# Altium schematic sheet BMS_BatteryStackMonitor.SchDoc
size A
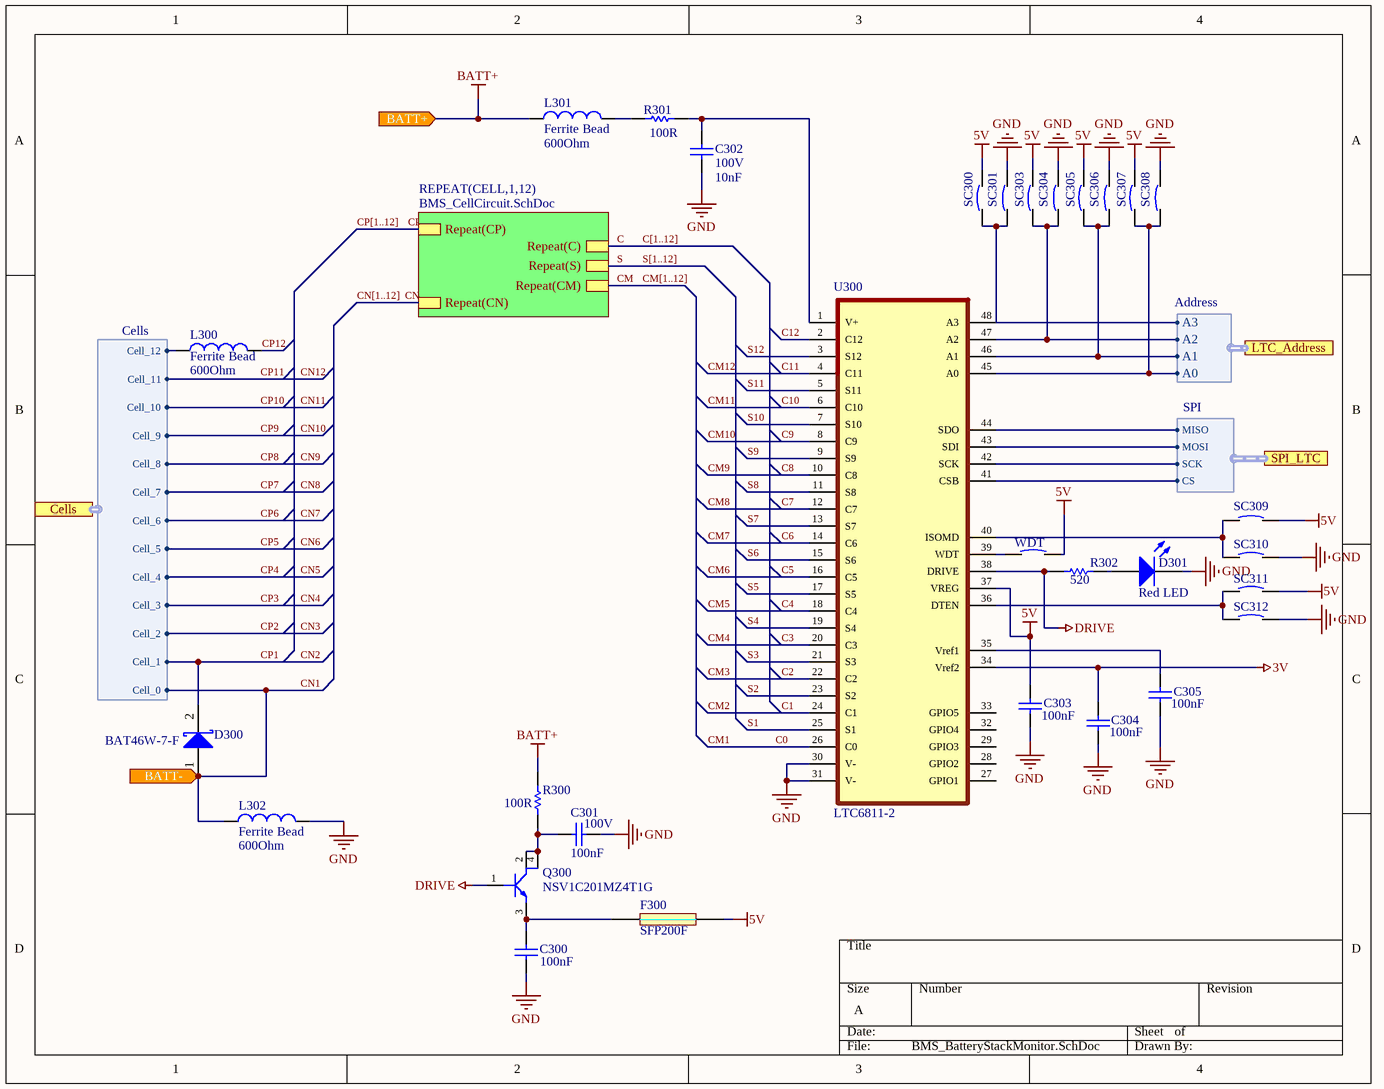
[diagram p0: BMS_BatteryStackMonitor.SchDoc]

## Parts
C300  value 100nF  [CAPC2012X14N]  (hidden comment: 100V)
C301  100V  value 100nF  [CAPC2012X14N]
C302  100V  value 10nF  [CAPC2012X14N]
C303  value 100nF  [CAPC2012X14N]  (hidden comment: 100V)
C304  value 100nF  [CAPC2012X14N]  (hidden comment: 100V)
C305  value 100nF  [CAPC2012X14N]  (hidden comment: 100V)
D300  BAT46W-7-F  [SODFL370X135-2N]
D301  Red LED  [SMD RED LED]
F300  SFP200F  [DIOC3216X12N]
L300  Ferrite Bead  value 600Ohm  [INDC3216X13N]
L301  Ferrite Bead  value 600Ohm  [INDC3216X13N]
L302  Ferrite Bead  value 600Ohm  [INDC3216X13N]
Q300  NSV1C201MZ4T1G  [SOT230P700X180-4N]
R300  value 100R  [RESC2012X07N]  (hidden comment: R0805)
R301  value 100R  [RESC2012X07N]  (hidden comment: R0805)
R302  value 520  [RESC2012X07N]  (hidden comment: R0805)
SC300  Short Circuit  [RESC2012X07N]  (value not drawn)
SC301  Short Circuit  [RESC2012X07N]  (value not drawn)
SC303  Short Circuit  [RESC2012X07N]  (value not drawn)
SC304  Short Circuit  [RESC2012X07N]  (value not drawn)
SC305  Short Circuit  [RESC2012X07N]  (value not drawn)
SC306  Short Circuit  [RESC2012X07N]  (value not drawn)
SC307  Short Circuit  [RESC2012X07N]  (value not drawn)
SC308  Short Circuit  [RESC2012X07N]  (value not drawn)
SC309  Short Circuit  [RESC2012X07N]  (value not drawn)
SC310  Short Circuit  [RESC2012X07N]  (value not drawn)
SC311  Short Circuit  [RESC2012X07N]  (value not drawn)
SC312  Short Circuit  [RESC2012X07N]  (value not drawn)
U300  LTC6811-2  [SSOP50P780X200-48N]
WDT  Short Circuit  [RESC2012X07N]  (value not drawn)

## Sub-sheets
REPEAT(CELL,1,12) = BMS_CellCircuit.SchDoc: Repeat(CP), Repeat(CN), Repeat(C), Repeat(CM), Repeat(S)

## Ports
BATT+ (in), BATT- (in), Cells (harness Cells), LTC_Address (harness Address), SPI_LTC (harness SPI)

## Harnesses
Cells: Cell_0, Cell_1, Cell_2, Cell_3, Cell_4, Cell_5, Cell_6, Cell_7, Cell_8, Cell_9, Cell_10, Cell_11, Cell_12
SPI: MISO, MOSI, SCK, CS
Address: A3, A2, A1, A0

## Nets
3V: C304.1 U300.34(Vref2)
5V: C303.1 F300.2 SC300.2 SC303.2 SC305.2 SC307.2 SC309.2 SC311.2 U300.37(VREG) WDT.2
BATT+: L301.1 R300.1 ; port BATT+
DRIVE: Q300.1 R302.2 U300.38(DRIVE)
GND: C300.2 C301.2 C302.2 C303.2 C304.2 C305.2 D301.2(K) L302.2 SC301.2 SC304.2 SC306.2 SC308.2 SC310.2 SC312.2 U300.30(V-) U300.31(V-)
C: sheet REPEAT(CELL,1,12)/Repeat(C)
C0: U300.26(C0)  [also labelled CM1]
C1: U300.24(C1)  [also labelled CM2]
C2: U300.22(C2)  [also labelled CM3]
C3: U300.20(C3)  [also labelled CM4]
C4: U300.18(C4)  [also labelled CM5]
C5: U300.16(C5)  [also labelled CM6]
C6: U300.14(C6)  [also labelled CM7]
C7: U300.12(C7)  [also labelled CM8]
C8: U300.10(C8)  [also labelled CM9]
C9: U300.8(C9)  [also labelled CM10]
C10: U300.6(C10)  [also labelled CM11]
C11: U300.4(C11)  [also labelled CM12]
C12: U300.2(C12)
CM: sheet REPEAT(CELL,1,12)/Repeat(CM)
CN: sheet REPEAT(CELL,1,12)/Repeat(CN)
CN1: D300.1(A) L302.1 ; port BATT-, port Cells.Cell_0
CN2: D300.2(K) ; port Cells.Cell_1  [also labelled CP1]
CN3: port Cells.Cell_2  [also labelled CP2]
CN4: port Cells.Cell_3  [also labelled CP3]
CN5: port Cells.Cell_4  [also labelled CP4]
CN6: port Cells.Cell_5  [also labelled CP5]
CN7: port Cells.Cell_6  [also labelled CP6]
CN8: port Cells.Cell_7  [also labelled CP7]
CN9: port Cells.Cell_8  [also labelled CP8]
CN10: port Cells.Cell_9  [also labelled CP9]
CN11: port Cells.Cell_10  [also labelled CP10]
CN12: port Cells.Cell_11  [also labelled CP11]
CP: sheet REPEAT(CELL,1,12)/Repeat(CP)
CP12: L300.2
S: sheet REPEAT(CELL,1,12)/Repeat(S)
S1: U300.25(S1)
S2: U300.23(S2)
S3: U300.21(S3)
S4: U300.19(S4)
S5: U300.17(S5)
S6: U300.15(S6)
S7: U300.13(S7)
S8: U300.11(S8)
S9: U300.9(S9)
S10: U300.7(S10)
S11: U300.5(S11)
S12: U300.3(S12)
NetC300_1: C300.1 F300.1 Q300.3
NetC301_1: C301.1 Q300.2 Q300.4 R300.2
NetC302_1: C302.1 R301.1 U300.1(V+)
NetC305_1: C305.1 U300.35(Vref1)
NetD301_1: D301.1(A) R302.1
NetL300_1: L300.1 ; port Cells.Cell_12
NetL301_2: L301.2 R301.2
NetSC300_1: SC300.1 SC301.1 U300.48(A3) ; port LTC_Address.A3
NetSC303_1: SC303.1 SC304.1 U300.47(A2) ; port LTC_Address.A2
NetSC305_1: SC305.1 SC306.1 U300.46(A1) ; port LTC_Address.A1
NetSC307_1: SC307.1 SC308.1 U300.45(A0) ; port LTC_Address.A0
NetSC309_1: SC309.1 SC310.1 U300.40(ISOMD)
NetSC311_1: SC311.1 SC312.1 U300.36(DTEN)
NetU300_39: U300.39(WDT) WDT.1
NetU300_41: U300.41(CSB) ; port SPI_LTC.CS
NetU300_42: U300.42(SCK) ; port SPI_LTC.SCK
NetU300_43: U300.43(SDI) ; port SPI_LTC.MOSI
NetU300_44: U300.44(SDO) ; port SPI_LTC.MISO

Not connected (* = marked no-connect by the designer): U300 27(GPIO1) 28(GPIO2) 29(GPIO3) 32(GPIO4) 33(GPIO5)

## Buses and harness runs
bus C[1..12]
bus CM[1..12]
bus CN[1..12]
bus CP[1..12]
bus S[1..12]

## Library data of the parts
C300-C305 = Cap: Capacitor; Published: 8-Jun-2000; LatestRevisionDate: 17-Jul-2002; LatestRevisionNote: Re-released for DXP Platform.; PackageReference: RAD-0.3; Publisher: Altium Limited; PackageDescription: Radial Cap, Thru-Hole; 2 Leads; 0.3 in Pin Spacing
D300 = Diode BAT17: Silicon RF Schottky Diode for Mixer Applications in the VHF/UHF Range; Note: Pin 2 is not connected and not drawn.; Published: 21-Mar-2003; LatestRevisionDate: 29-May-2009; LatestRevisionNote: IPC-7351 Footprint Added.; DatasheetVersion: Oct-1999; PackageVersion: Sep-2001; PackageReference: SOT-23; Publisher: Altium Limited; PackageDescription: 3-Pin SOT-23 Package 0.95 mm Pitch, 2.5 mm Lead Span; ComponentLink1Description: Manufacturer Link; ComponentLink1URL: http://www.infineon.com/; ComponentLink2Description: Datasheet; ComponentLink2URL: http://www.infineon.com/upload/Document/cmc_upload/documents/009/363/bat17series.pdf
D301 = LED0: Typical INFRARED GaAs LED; Published: 8-Jun-2000; LatestRevisionDate: 08-Jul-2005; LatestRevisionNote: Mech Layer 1 removed.; PackageReference: LED-0; Publisher: Altium Limited; PackageDescription: LED; 2 Leads
F300 = SFP200F: Surface Mount Fuses VERY FAST GLASS CER 63V 2A SZ 1206
L300 L302 = Inductor: Code_IEC: 1005; Published: 8-Jun-2000; LatestRevisionDate: 29-May-2009; LatestRevisionNote: IPC-7351 Footprint Added.; PackageReference: 0402-A; Publisher: Altium Limited; PackageDescription: Chip Inductor; Code_JEITA: 0402
L301 = Inductor: Inductor Coil - Ferrite Bead; Code_IEC: 1005; Published: 8-Jun-2000; LatestRevisionDate: 29-May-2009; LatestRevisionNote: IPC-7351 Footprint Added.; PackageReference: 0402-A; Publisher: Altium Limited; PackageDescription: Chip Inductor; Code_JEITA: 0402
Q300 = NSV1C201MZ4T1G: 100V, 2.0A, LOW Vce(sat), NPN Transistor
R300-R302 = Res1: Resistor; Published: 8-Jun-2000; LatestRevisionDate: 17-Jul-2002; LatestRevisionNote: Re-released for DXP Platform.; PackageReference: AXIAL-0.3; Publisher: Altium Limited; PackageDescription: Axial Device, Thru-Hole; 2 Leads; 0.3 in Pin Spacing
U300 = LTC6811-2: LTC6811-2, Multicell Battery Monitor, 48-Lead SSOP Package